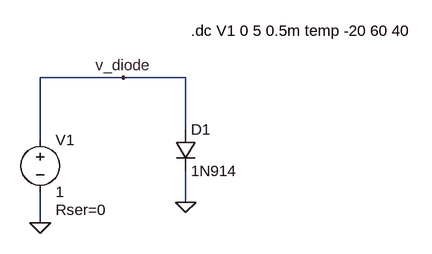
[diagram p0: schematic priklad1.asc]
priklad1.asc, the LTspice schematic file:
Version 4
SHEET 1 880 680
WIRE 80 0 -48 0
WIRE 176 0 80 0
WIRE 176 80 176 0
WIRE -48 96 -48 0
WIRE 176 192 176 144
WIRE -48 224 -48 176
FLAG -48 224 0
FLAG 176 192 0
FLAG 80 0 v_diode
SYMBOL voltage -48 80 R0
WINDOW 123 0 0 Left 2
WINDOW 39 24 124 Left 2
SYMATTR InstName V1
SYMATTR Value 1
SYMATTR SpiceLine Rser=0
SYMBOL diode 160 80 R0
SYMATTR InstName D1
SYMATTR Value 1N914
TEXT 184 -72 Left 2 !.dc V1 0 5 0.5m temp -20 60 40

The netlist it stands for:
* priklad1.asc
V1 v_diode 0 1 Rser=0
D1 v_diode 0 1N914
.model D D
.lib standard.dio
.dc V1 0 5 0.5m temp -20 60 40
.backanno
.end